# EAGLE schematic HOMADOS (EAGLE 7.7.0)
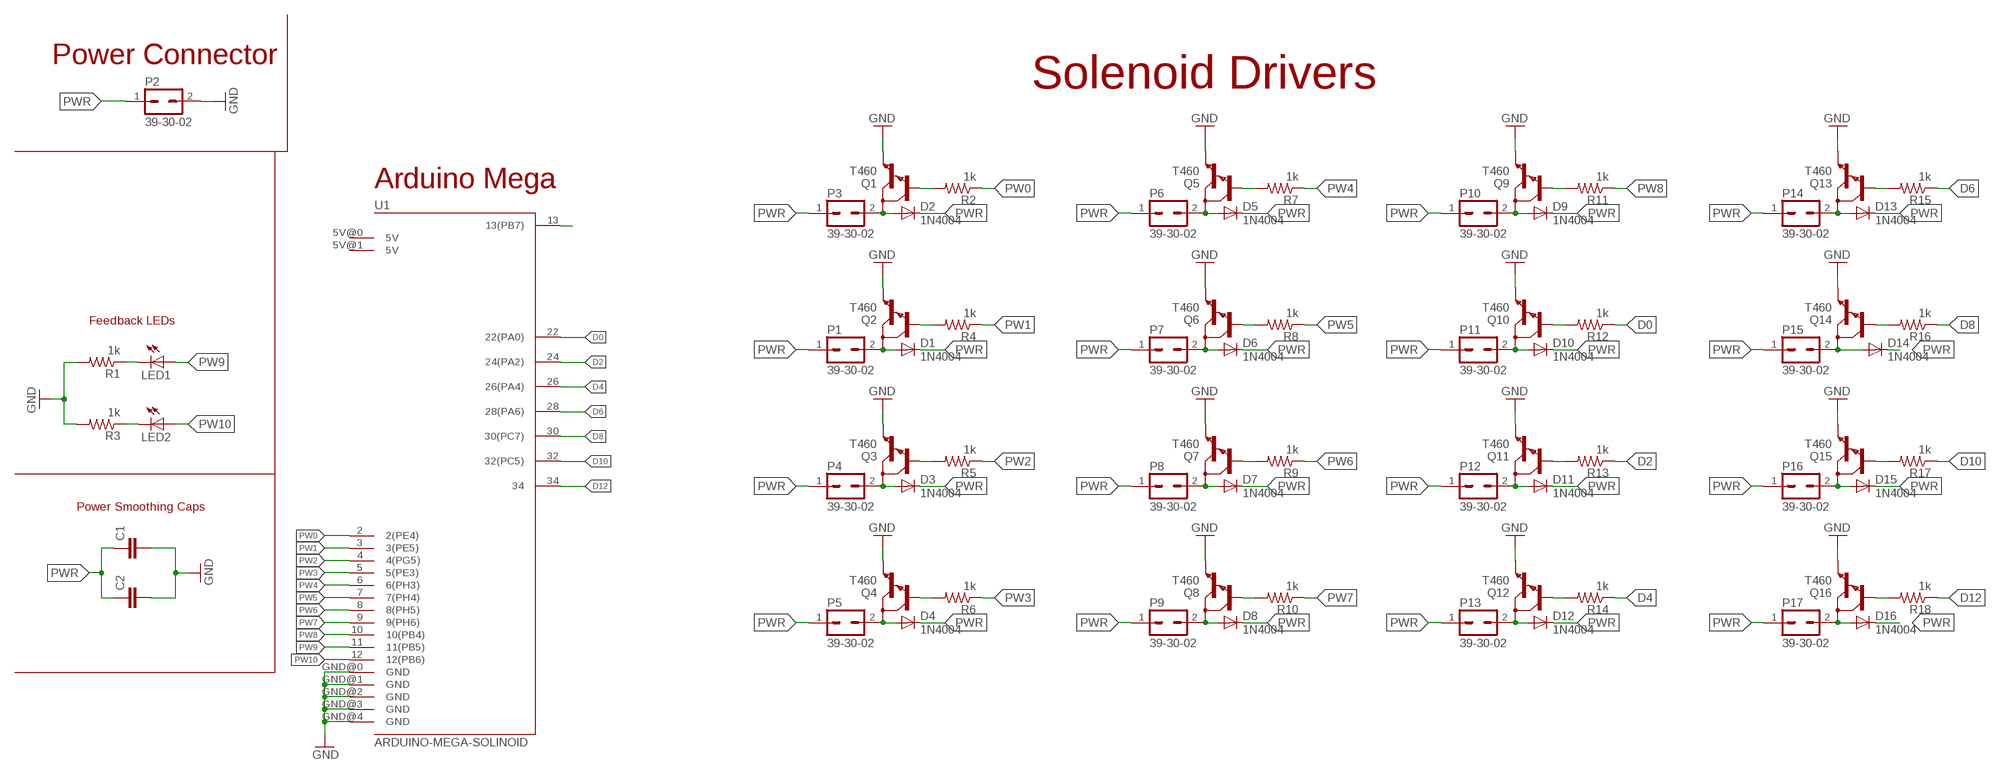
[diagram p0: schematic, sheet 1]

## Parts
C1  CAPPTH1  [CAP-PTH-5MM]
C2  CAPPTH3  [CAP-PTH-LARGE]
D1  1N4004  [DO41-10]
D2  1N4004  [DO41-10]
D3  1N4004  [DO41-10]
D4  1N4004  [DO41-10]
D5  1N4004  [DO41-10]
D6  1N4004  [DO41-10]
D7  1N4004  [DO41-10]
D8  1N4004  [DO41-10]
D9  1N4004  [DO41-10]
D10  1N4004  [DO41-10]
D11  1N4004  [DO41-10]
D12  1N4004  [DO41-10]
D13  1N4004  [DO41-10]
D14  1N4004  [DO41-10]
D15  1N4004  [DO41-10]
D16  1N4004  [DO41-10]
LED1  LED5MM  [LED5MM]
LED2  LED5MM  [LED5MM]
P1  39-30-02  [39-30-?02?]
P2  39-30-02  [39-30-?02?]
P3  39-30-02  [39-30-?02?]
P4  39-30-02  [39-30-?02?]
P5  39-30-02  [39-30-?02?]
P6  39-30-02  [39-30-?02?]
P7  39-30-02  [39-30-?02?]
P8  39-30-02  [39-30-?02?]
P9  39-30-02  [39-30-?02?]
P10  39-30-02  [39-30-?02?]
P11  39-30-02  [39-30-?02?]
P12  39-30-02  [39-30-?02?]
P13  39-30-02  [39-30-?02?]
P14  39-30-02  [39-30-?02?]
P15  39-30-02  [39-30-?02?]
P16  39-30-02  [39-30-?02?]
P17  39-30-02  [39-30-?02?]
Q1  T460  MJE800  [TO225AAV]
Q2  T460  MJE800  [TO225AAV]
Q3  T460  MJE800  [TO225AAV]
Q4  T460  MJE800  [TO225AAV]
Q5  T460  MJE800  [TO225AAV]
Q6  T460  MJE800  [TO225AAV]
Q7  T460  MJE800  [TO225AAV]
Q8  T460  MJE800  [TO225AAV]
Q9  T460  MJE800  [TO225AAV]
Q10  T460  MJE800  [TO225AAV]
Q11  T460  MJE800  [TO225AAV]
Q12  T460  MJE800  [TO225AAV]
Q13  T460  MJE800  [TO225AAV]
Q14  T460  MJE800  [TO225AAV]
Q15  T460  MJE800  [TO225AAV]
Q16  T460  MJE800  [TO225AAV]
R1  1k  RESISTORKIT  [AXIAL-0.3-KIT]
R2  1k  RESISTORKIT  [AXIAL-0.3-KIT]
R3  1k  RESISTORKIT  [AXIAL-0.3-KIT]
R4  1k  RESISTORKIT  [AXIAL-0.3-KIT]
R5  1k  RESISTORKIT  [AXIAL-0.3-KIT]
R6  1k  RESISTORKIT  [AXIAL-0.3-KIT]
R7  1k  RESISTORKIT  [AXIAL-0.3-KIT]
R8  1k  RESISTORKIT  [AXIAL-0.3-KIT]
R9  1k  RESISTORKIT  [AXIAL-0.3-KIT]
R10  1k  RESISTORKIT  [AXIAL-0.3-KIT]
R11  1k  RESISTORKIT  [AXIAL-0.3-KIT]
R12  1k  RESISTORKIT  [AXIAL-0.3-KIT]
R13  1k  RESISTORKIT  [AXIAL-0.3-KIT]
R14  1k  RESISTORKIT  [AXIAL-0.3-KIT]
R15  1k  RESISTORKIT  [AXIAL-0.3-KIT]
R16  1k  RESISTORKIT  [AXIAL-0.3-KIT]
R17  1k  RESISTORKIT  [AXIAL-0.3-KIT]
R18  1k  RESISTORKIT  [AXIAL-0.3-KIT]
U1  ARDUINO-MEGA-SOLINOID  [ARDUINO_MEGA-SOLINOID]

## Nets
D0: R12.P$1 U1.22(22(PA0))
D2: R13.P$1 U1.24(24(PA2))
D4: R14.P$1 U1.26(26(PA4))
D6: R15.P$1 U1.28(28(PA6))
D8: R16.P$1 U1.30(30(PC7))
D10: R17.P$1 U1.32(32(PC5))
D12: R18.P$1 U1.34
GND: C1.2 C2.2 P2.2 Q1.1(E) Q2.1(E) Q3.1(E) Q4.1(E) Q5.1(E) Q6.1(E) Q7.1(E) Q8.1(E) Q9.1(E) Q10.1(E) Q11.1(E) Q12.1(E) Q13.1(E) Q14.1(E) Q15.1(E) Q16.1(E) R1.P$2 R3.P$2 U1.GND@0(GND) U1.GND@1(GND) U1.GND@2(GND) U1.GND@3(GND) U1.GND@4(GND)
N$1: LED1.K(C) R1.P$1
N$2: D2.A P3.2 Q1.2(C)
N$3: LED2.K(C) R3.P$1
N$4: D1.A P1.2 Q2.2(C)
N$5: U1.13(13(PB7))
N$7: Q1.3(B) R2.P$2
N$10: Q2.3(B) R4.P$2
N$11: D3.A P4.2 Q3.2(C)
N$14: Q3.3(B) R5.P$2
N$15: D4.A P5.2 Q4.2(C)
N$18: Q4.3(B) R6.P$2
N$19: D5.A P6.2 Q5.2(C)
N$22: Q5.3(B) R7.P$2
N$23: D6.A P7.2 Q6.2(C)
N$26: Q6.3(B) R8.P$2
N$27: D7.A P8.2 Q7.2(C)
N$30: Q7.3(B) R9.P$2
N$31: D8.A P9.2 Q8.2(C)
N$34: Q8.3(B) R10.P$2
N$35: D9.A P10.2 Q9.2(C)
N$38: Q9.3(B) R11.P$2
N$39: D10.A P11.2 Q10.2(C)
N$42: Q10.3(B) R12.P$2
N$43: D11.A P12.2 Q11.2(C)
N$46: Q11.3(B) R13.P$2
N$47: D12.A P13.2 Q12.2(C)
N$50: Q12.3(B) R14.P$2
N$51: D13.A P14.2 Q13.2(C)
N$54: Q13.3(B) R15.P$2
N$55: D14.A P15.2 Q14.2(C)
N$58: Q14.3(B) R16.P$2
N$59: D15.A P16.2 Q15.2(C)
N$62: Q15.3(B) R17.P$2
N$63: D16.A P17.2 Q16.2(C)
N$66: Q16.3(B) R18.P$2
PW0: R2.P$1 U1.2(2(PE4))
PW1: R4.P$1 U1.3(3(PE5))
PW2: R5.P$1 U1.4(4(PG5))
PW3: R6.P$1 U1.5(5(PE3))
PW4: R7.P$1 U1.6(6(PH3))
PW5: R8.P$1 U1.7(7(PH4))
PW6: R9.P$1 U1.8(8(PH5))
PW7: R10.P$1 U1.9(9(PH6))
PW8: R11.P$1 U1.10(10(PB4))
PW9: LED1.A U1.11(11(PB5))
PW10: LED2.A U1.12(12(PB6))
PWR: C1.1 C2.1 D1.C D2.C D3.C D4.C D5.C D6.C D7.C D8.C D9.C D10.C D11.C D12.C D13.C D14.C D15.C D16.C P1.1 P2.1 P3.1 P4.1 P5.1 P6.1 P7.1 P8.1 P9.1 P10.1 P11.1 P12.1 P13.1 P14.1 P15.1 P16.1 P17.1
Unconnected: U1.5V@0(5V) U1.5V@1(5V)

## Notes on the sheet
- Power Connector
- Solenoid Drivers
- Arduino Mega
- Feedback LEDs
- Power Smoothing Caps

## Library data of the parts
C1 C2 = SparkFun-Passives:CAP: Capacitor Standard 0603 ceramic capacitor, and 0.1" leaded capacitor.
D1-D16 = adafruit:1N4004: DIODE General purpose 1N400x type rectifier (With bigger pads) http://www.ladyada.net/library/pcb/eaglelibrary.html
LED1 LED2 = adafruit:LED: LED OSRAM: - CHIPLED LG R971, LG N971, LY N971, LG Q971, LY Q971, LO R971, LY R971 LH N974, LH R974 LS Q976, LO Q976, LY Q976 LO Q996 - Hyper CHIPLED LW Q18S LB Q993, LB Q99A, LB R99A - SideLED LS A670, LO A670, LY A670, LG A670, LP A670 LB A673, LV A673, LT A673, LW A673 LH A674 LY A675 LS A676, LA A676, LO A676, LY A676, LW A676 LS A679, LY A679, LG A679 - Hyper Micro SIDELED® LS Y876, LA Y876, LO Y876, LY Y876 LT Y87S - SmartLED LW L88C, LW L88S LB L89C, LB L89S, LG L890 LS L89K, LO L89K, LY L89K LS L896, LA L896, LO L896, LY L896 - TOPLED LS T670, LO T670, LY T670, LG T670, LP T670 LSG T670, LSP T670, LSY T670, LOP T670, LYG T670 LG T671, LOG T671, LSG T671 LB T673, LV T673, LT T673, LW T673 LH T674 LS T676, LA T676, LO T676, LY T676, LB T676, LH T676, LSB T676, LW T676 LB T67C, LV T67C, LT T67C, LS T67K, LO T67K, LY T67K, LW E67C LS E67B, LA E67B, LO E67B, LY E67B, LB E67C, LV E67C, LT E67C LW T67C LS T679, LY T679, LG T679 LS T770, LO T770, LY T770, LG T770, LP T770 LB T773, LV T773, LT T773, LW T773 LH T774 LS E675, LA E675, LY E675, LS T675 LS T776, LA T776, LO T776, LY T776, LB T776 LHGB T686 LT T68C, LB T68C - Hyper Mini TOPLED® LB M676 - Mini TOPLED Santana® LG M470 LS M47K, LO M47K, LY M47K Source: http://www.osram.convergy.de/
P1-P17 = con-molex-mini-fit:39-30-?02?: HEADER
Q1-Q16 = transistor-npn:MJE800*: NPN Darlington Transistor
R1-R18 = SparkFun-Passives:RESISTOR: Resistor Basic schematic elements and footprints for 0603, 1206, and PTH resistors.
U1 = Nathans-Arduinos2:ARDUINO-MEGA-SOLINOID: Arduino Mega board footprint

## Net classes
0 default: width 0.762 mm, drill 0.762 mm, clearance 0.508 mm
1 PWR: width 1.016 mm, drill 0.762 mm, clearance 0.508 mm
2 GND: width 1.016 mm, drill 0.762 mm, clearance 0.508 mm